# EAGLE design RH026.1 (EAGLE 7.1.0)
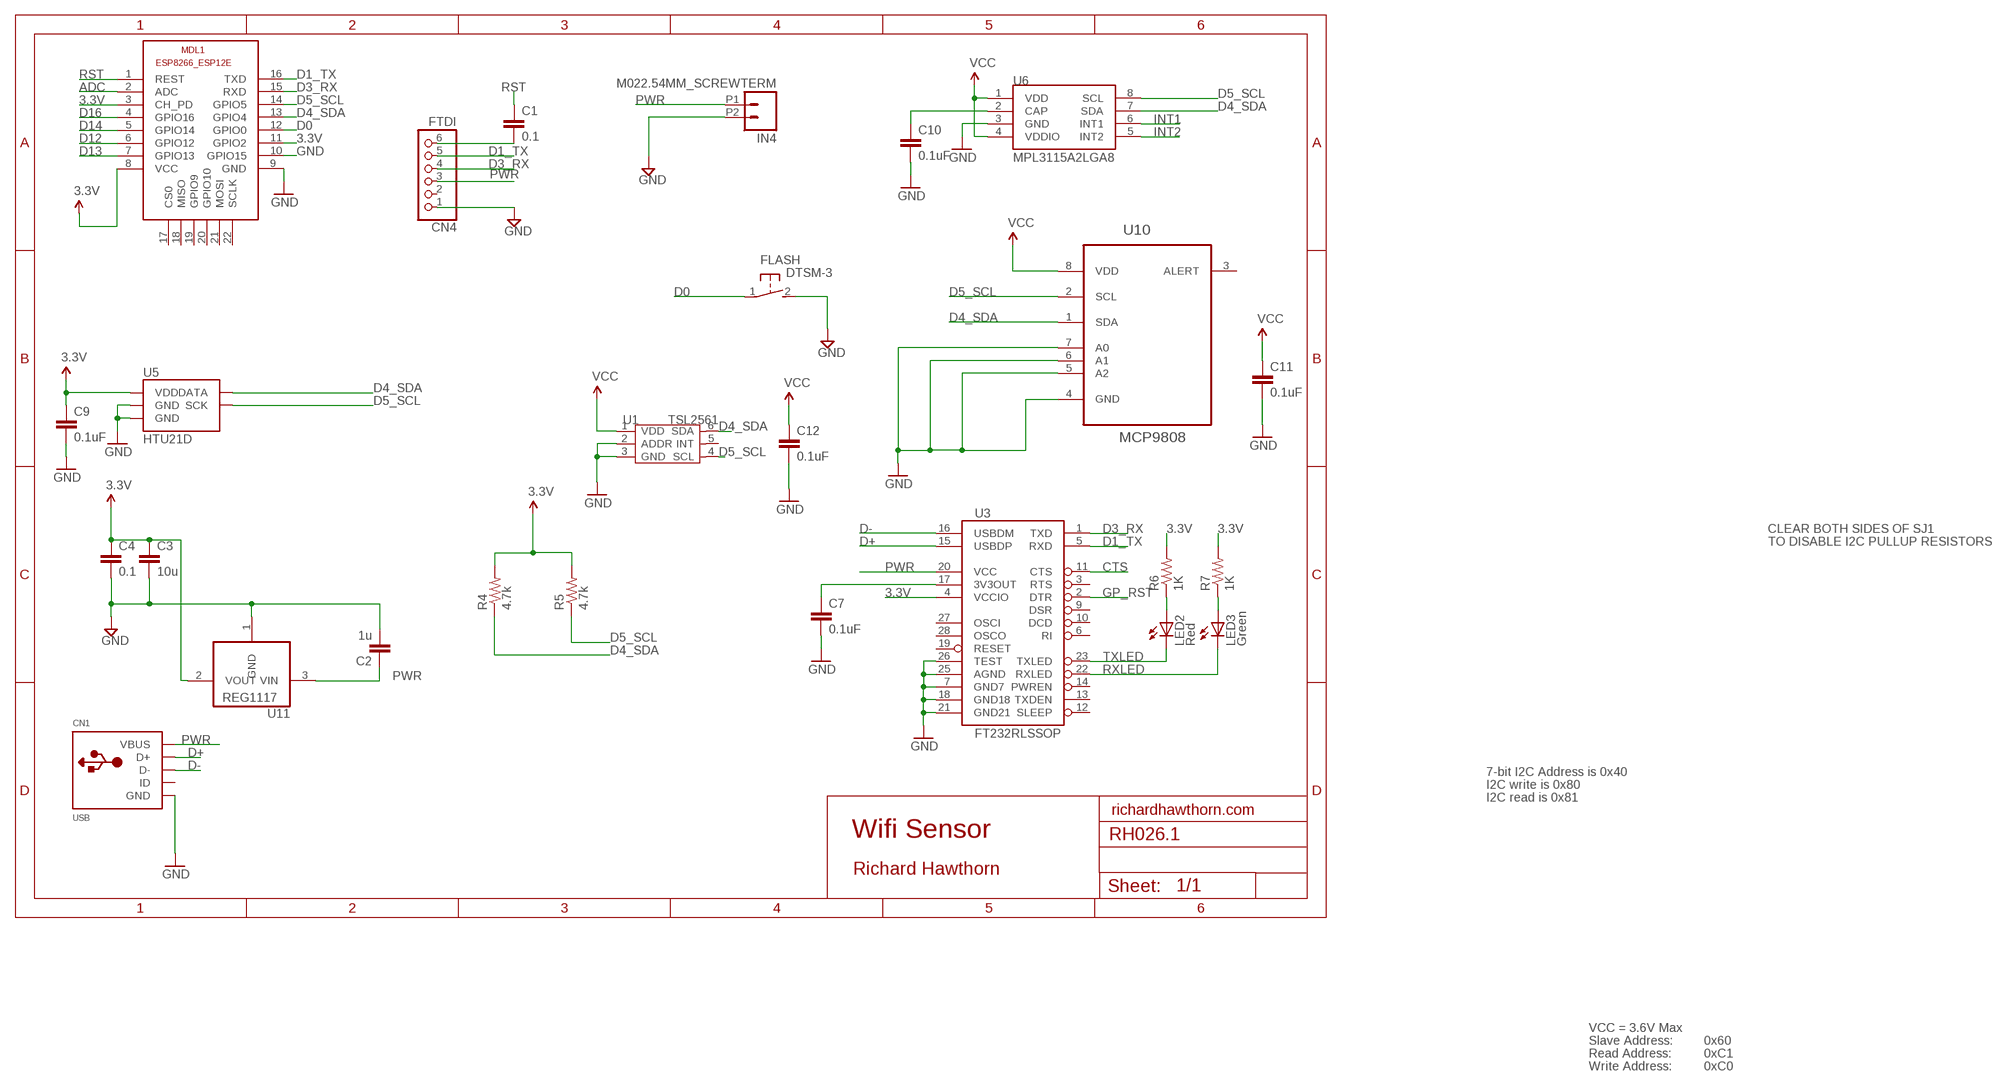
[diagram p0: schematic, sheet 1]

## Parts
C1  0.1  CAP0603-CAP  [0603-CAP]
C2  1u  CAP0603-CAP  [0603-CAP]
C3  10u  CAP0805-CAP  [0805-CAP]
C4  0.1  CAP0603-CAP  [0603-CAP]
C7  0.1uF  CAP0402-CAP  [0402-CAP]
C9  0.1uF  CAP0805  [0805]
C10  0.1uF  CAP0805  [0805]
C11  0.1uF  CAP0603-CAP  [0603-CAP]
C12  0.1uF  CAP0603-CAP  [0603-CAP]
CN1  USB  USBMINIB  [USB-MINIB]
CN4  FTDI  PINHD-1X6  [1X06]
FLASH  DTSM-3  [DTSM-3]
IN4  M022.54MM_SCREWTERM  [1X02_2.54_SCREWTERM]
LED2  Red  LED0603  [LED-0603]
LED3  Green  LED0603  [LED-0603]
MDL1  ESP8266-12EESP8266-ESP12E  [ESP8266-ESP12E]
R4  4.7k  RESISTOR0805-RES  [0805]
R5  4.7k  RESISTOR0805-RES  [0805]
R6  1K  RESISTOR0402-RES  [0402-RES]
R7  1K  RESISTOR0402-RES  [0402-RES]
U1  TSL2561  TSL2561T  [TMB-6]
U3  FT232RLSSOP  [SSOP28DB]
U5  HTU21D  HTU21DSMD  [HTU21D]
U6  MPL3115A2LGA8  [LGA8]
U10  MCP9808  MCP9808-E/MS  [SOP65P490X110-8N]
U11  REG1117  [SOT223]

## Nets
3.3V: C3.1 C4.1 C9.1 C11.1 C12.1 MDL1.3(CH_PD) MDL1.8(VCC) MDL1.11(GPIO2) R4.2 R5.2 R6.2 R7.2 U1.1(VDD) U3.4(VCCIO) U5.VDD U6.1(VDD) U6.4(VDDIO) U10.8(VDD) U11.2(VOUT) ; supply symbol labelled VCC
3.3VOUT: C7.1 U3.17(3V3OUT)
ADC: MDL1.2(ADC)
CTS: U3.11(CTS)
D0: FLASH.1 MDL1.12(GPIO0)
D1_TX: CN4.5 MDL1.16(TXD) U3.5(RXD)
D3_RX: CN4.4 MDL1.15(RXD) U3.1(TXD)
D4_SDA: MDL1.13(GPIO4) R4.1 U1.6(SDA) U5.DATA U6.7(SDA) U10.1(SDA)
D5_SCL: MDL1.14(GPIO5) R5.1 U1.4(SCL) U5.SCK U6.8(SCL) U10.2(SCL)
D12: MDL1.6(GPIO12)
D13: MDL1.7(GPIO13)
D14: MDL1.5(GPIO14)
D16: MDL1.4(GPIO16)
D+: CN1.D+ U3.15(USBDP)
D-: CN1.D- U3.16(USBDM)
GND [power]: C2.2 C3.2 C4.2 C7.2 C9.2 C10.2 C11.2 C12.2 CN1.GND CN4.1 FLASH.2 IN4.P2 MDL1.9(GND) MDL1.10(GPIO15) U1.2(ADDR) U1.3(GND) U3.7(GND7) U3.18(GND18) U3.21(GND21) U3.25(AGND) U3.26(TEST) U5.7(GND) U5.GND U6.3(GND) U10.4(GND) U10.5(A2) U10.6(A1) U10.7(A0) U11.1(GND)
GP_RST: U3.2(DTR)
INT1: U6.6(INT1)
INT2: U6.5(INT2)
N$2: LED2.A R6.1
N$3: LED3.A R7.1
N$9: C10.1 U6.2(CAP)
N$20: C1.2 CN4.6
PWR [power]: C2.1 CN1.VBUS CN4.3 IN4.P1 U3.20(VCC) U11.3(VIN)
RST: C1.1 MDL1.1(REST)
RXLED: LED3.C U3.22(RXLED)
TXLED: LED2.C U3.23(TXLED)
Unconnected: CN1.ID CN4.2 MDL1.17(CS0) MDL1.18(MISO) MDL1.19(GPIO9) MDL1.20(GPIO10) MDL1.21(MOSI) MDL1.22(SCLK) U1.5(INT) U3.3(RTS) U3.6(RI) U3.9(DSR) U3.10(DCD) U3.12(SLEEP) U3.13(TXDEN) U3.14(PWREN) U3.19(RESET) U3.27(OSCI) U3.28(OSCO) U10.3(ALERT)

## Notes on the sheet
- CLEAR BOTH SIDES OF SJ1
- TO DISABLE I2C PULLUP RESISTORS
- 7-bit I2C Address is 0x40
- I2C write is 0x80
- I2C read is 0x81
- richardhawthorn.com
- Wifi Sensor
- Richard Hawthorn
- VCC = 3.6V Max
- Slave Address: | 0x60
- Read Address: | 0xC1
- Write Address: | 0xC0

## Library data of the parts
C1-C4 = LowPowerLab:CAP: Capacitor Standard 0603 ceramic capacitor, and 0.1" leaded capacitor.
C7 C9-C12 = SparkFun:CAP: Capacitor Standard 0603 ceramic capacitor, and 0.1" leaded capacitor.
CN1 = LowPowerLab:USB: USB Connectors USBMINIB - Surface Mount Female Mini-B USB Connector 4UConnector: 06564 By microbuilder.eu Thru-hole RA Female Mini-B USB Connector 4UConnector: 18732 By ladyada.net
CN4 = pinhead:PINHD-1X6: PIN HEADER
FLASH = switch-tact:DTSM-3
IN4 = SparkFun-Connectors:M02: Standard 2-pin 0.1" header. Use with - straight break away headers ( PRT-00116) - right angle break away headers (PRT-00553) - swiss pins (PRT-00743) - machine pins (PRT-00117) - female headers (PRT-00115) Molex polarized connector foot print use with: PRT-08233 with associated crimp pins and housings. 2.54_SCREWTERM for use with PRT-10571. 3.5mm Screw Terminal footprints for PRT-08084 5mm Screw Terminal footprints for use with PRT-08432
LED2 LED3 = SparkFun:LED: LEDs Standard schematic elements and footprints for 5mm, 3mm, 1206, and 0603 sized LEDs. 5mm - Spark Fun Electronics SKU : COM-00529 (and others)
MDL1 = ESP8266-ESP12E:ESP8266-12E: ESP8266-12E with additional I/O and GPIO04/05 corrected The author cannot warrant that this library is free from error or will meet your specific requirements. Created by PuceBaboon.com. Komagane, Nagano, JAPAN
R4-R7 = SparkFun:RESISTOR: Resistor Basic schematic elements and footprints for 0603, 1206, and PTH resistors.
U1 = template:TSL2561: Light-TO-Digital Converter
U3 = SparkFun:FT232RL: USB UART FT232RL 4th Generation USB UART (USB <-> Serial) Controller. Spark Fun Electronics SKU : COM-00650
U5 = SparkFun-Sensors:HTU21D
U6 = SparkFun-Sensors:MPL3115A2: Altimeter/Pressure Sensor, I2C, 1.95V-3.6V supply, 50 to 110kPa
U10 = Richard1:MCP9808-E/MS: Digital Temperature Sensor,MSOP-8; MPN: MCP9808-E/MS; OC_FARNELL: 2080523; OC_NEWARK: 89T8871; PACKAGE: MSOP-8; SUPPLIER: MICROCHIP
U11 = burr-brown:REG1117: 800mA and 1A Low Dropout (LDO) Positive Regulator 1.8V, 2.5V, 2.85V, 3.3V, 5V, and Adj; MPN: REG1117; OC_FARNELL: 1097566; OC_NEWARK: 14P6981

## Net classes
1 power: width 0.381 mm, clearance 0.254 mm

## Board
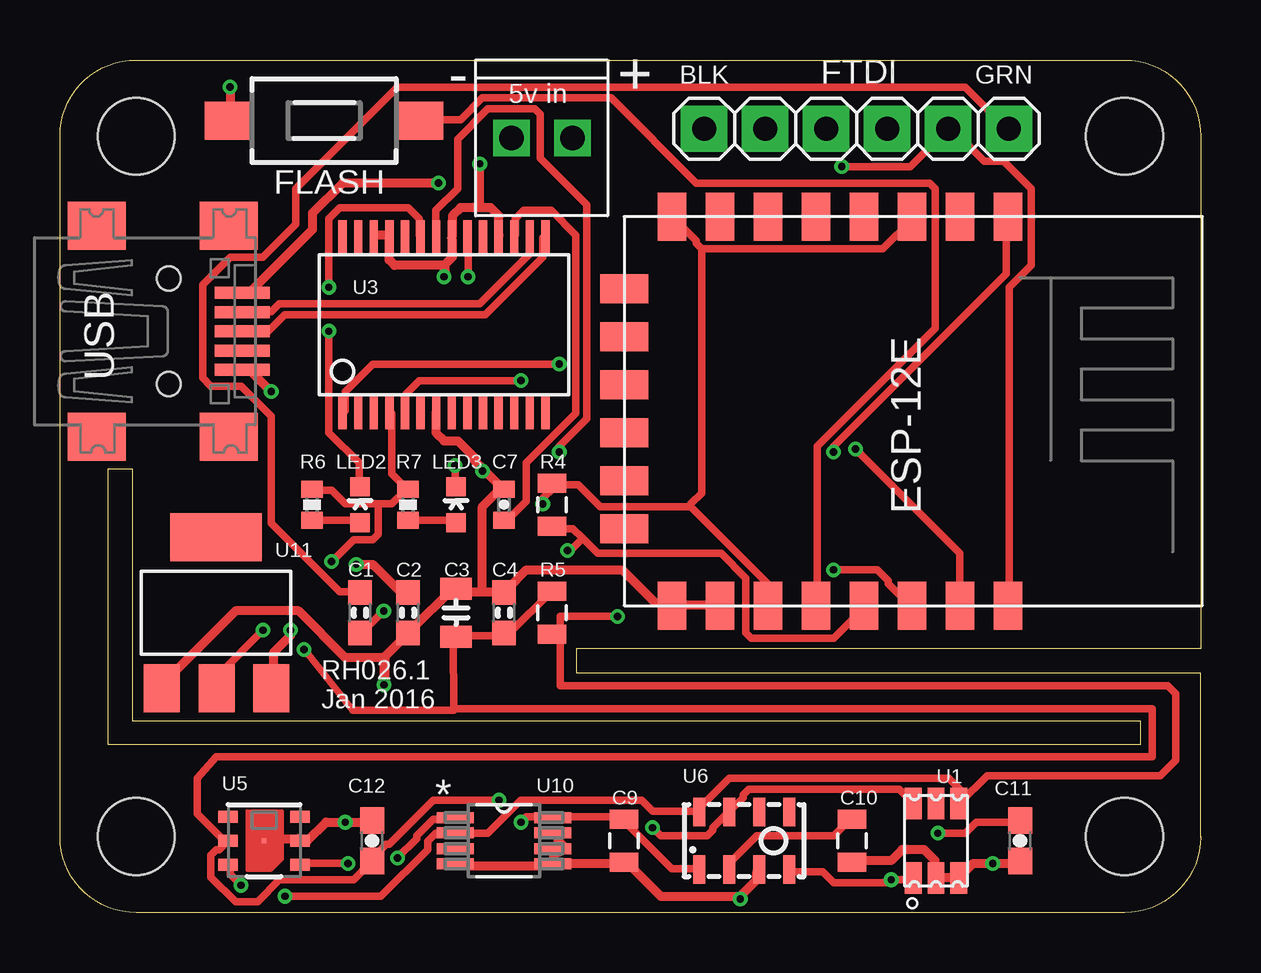
[diagram p1: board, top side]
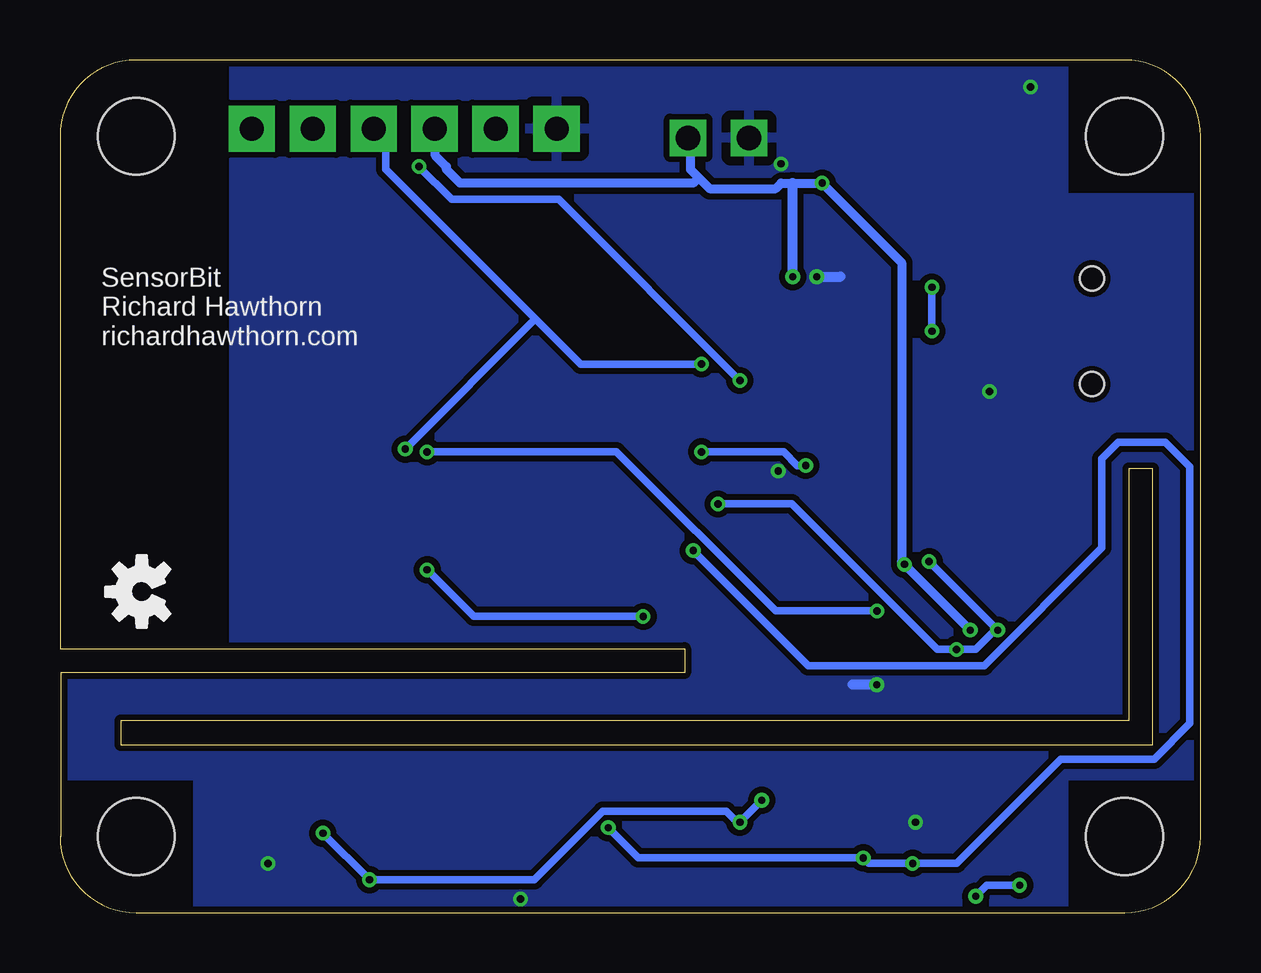
[diagram p2: board, bottom side, seen from below]

Size 47.53 x 35.53 mm. Coordinates in mm from the lower left corner, seen from the top.
Outline: 0,3.17 0,32.35 arc-90 3.17,35.53 44.35,35.53 arc-90 47.53,32.35 47.53,11 21.5,11 21.5,10 47.5,10 47.5,3.17 47.53,3.17 arc-90 44.35,0 3.17,0 arc-90 0,3.17
Outline: 2,7 2,18.5 3,18.5 3,8 45,8 45,7 2,7
Copper layers (1*16): Top 0.035mm / dielectric 1.5mm / Bottom 0.035mm
Design rules "ITEADstudio_DRC *": minimum track width 12mil, minimum drill 12mil, track to track 6mil, track to pad 6mil, pad to pad 6mil, via to via 6mil, smd to smd 0mil, copper to edge 10mil, drill to drill 10mil, minimum pad ring 10mil, minimum via ring 6mil, stop-mask expansion 2mil, vias tented up to drill 100mil, thermal gap 15mil
Holes 3.2 mm at 3.17,3.17 44.35,3.17 3.17,32.35 44.35,32.35
tRestrict: area 40.5,11 to 47.5,35.5; area 42,0 to 47.5,5.5; area 0,30 to 5.5,35.5; area 0,0 to 5.5,5.5
bRestrict: area 40.5,11 to 47.5,35.5; area 0,0 to 5.5,5.5; area 42,0 to 47.5,5.5; area 0,30 to 5.5,35.5

### Footprints (pad centres in the part's own frame; a part is rotated, then mirrored left to right if it is on the bottom)
0603-CAP = smd 1.016 x 0.965: 1 -0.85,0; 2 0.85,0
0805-CAP = smd 0.902 x 1.3: 1 -1,0; 2 1,0
0402-CAP = smd 0.7 x 0.9: 1 -0.65,0; 2 0.65,0
0805 = smd 0.8 x 1.2: 1 -0.9,0; 2 0.9,0
0603-CAP' = smd 1.1 x 1: 1 -0.85,0; 2 0.85,0
USB-MINIB = smd 0.5 x 2.308: D+ 0,4.064; D- -0.8,4.064; GND 1.6,4.064; ID 0.8,4.064; VBUS -1.6,4.064 | smd 2 x 2.4: GND1 -4.4,-2; GND2 -4.4,3.5; GND3 4.4,3.5; GND4 4.4,-2 | hole 1: -2.2,1; 2.2,1
1X06 = drill 1 pad 1.93 square: 1 -6.35,0; 2 -3.81,0; 3 -1.27,0; 4 1.27,0; 5 3.81,0; 6 6.35,0
DTSM-3 = smd 2 x 1.6: 1 -3.97,0; 2 3.97,0
1X02_2.54_SCREWTERM = drill 1.016 square: P1 2.54,0; P2 0,0
LED-0603 = smd 0.8 x 0.8: A 0,-0.75; C 0,0.75
ESP8266-ESP12E = smd 2 x 1.2: 1 0,16; 2 0,14; 3 0,12; 4 0,10; 5 0,8; 6 0,6; 7 0,4; 8 0,2; 9 16.2,2; 10 16.2,4; 11 16.2,6; 12 16.2,8; 13 16.2,10; 14 16.2,12; 15 16.2,14; 16 16.2,16 | smd 1.2 x 2: 17 11,0; 18 3,0; 19 5,0; 20 13,0; 21 7,0; 22 9,0
0402-RES = smd 0.7 x 0.9: 1 -0.65,0; 2 0.65,0
TMB-6 = smd 1.3 x 0.7: 1 -1.55,0.95; 2 -1.55,0; 3 -1.55,-0.95; 4 1.55,-0.95; 5 1.55,0; 6 1.55,0.95
SSOP28DB = smd 0.348 x 1.397: 1 -4.225,-3.656; 2 -3.575,-3.656; 3 -2.925,-3.656; 4 -2.275,-3.656; 5 -1.625,-3.656; 6 -0.975,-3.656; 7 -0.325,-3.656; 8 0.325,-3.656; 9 0.975,-3.656; 10 1.625,-3.656; 11 2.275,-3.656; 12 2.925,-3.656; 13 3.575,-3.656; 14 4.225,-3.656; 15 4.225,3.656; 16 3.575,3.656; 17 2.925,3.656; 18 2.275,3.656; 19 1.625,3.656; 20 0.975,3.656; 21 0.325,3.656; 22 -0.325,3.656; 23 -0.975,3.656; 24 -1.625,3.656; 25 -2.275,3.656; 26 -2.925,3.656; 27 -3.575,3.656; 28 -4.225,3.656
HTU21D = smd 0.2 x 0.2: 7 0,0 | smd 0.8 x 0.5: DATA 1.5,-1; GND 1.5,0; NC@1 -1.5,1; NC@6 1.5,1; SCK -1.5,-1; VDD -1.5,0
LGA8 = smd 1.2 x 0.5: 1 -1.2,1.875; 2 -1.2,0.625; 3 -1.2,-0.625; 4 -1.2,-1.875; 5 1.2,-1.875; 6 1.2,-0.625; 7 1.2,0.625; 8 1.2,1.875
SOP65P490X110-8N = smd 1.524 x 0.457: 1 -2.032,0.965; 2 -2.032,0.33; 3 -2.032,-0.33; 4 -2.032,-0.965; 5 2.032,-0.965; 6 2.032,-0.33; 7 2.032,0.33; 8 2.032,0.965
SOT223 = smd 1.499 x 2.007: 1 -2.261,-3.15; 2 0.025,-3.15; 3 2.311,-3.15 | smd 3.81 x 2.007: 4 0,3.15

### Placement (x,y rotation side)
C1  12.5,12.5 90 top
C2  14.5,12.5 270 top
C3  16.5,12.5 90 top
C4  18.5,12.5 90 top
C7  18.5,17 90 top
C9  23.5,3 270 top
C10  33,3 270 top
C11  0.1uF  [0603-CAP']  40,3 270 top
C12  0.1uF  [0603-CAP']  13,3 90 top
CN1  3.53,24.23 270 top
CN4  33.19,32.67 0 top
FLASH  11,33 180 top
IN4  18.82,32.28 0 top
LED2  12.5,17 0 top
LED3  16.5,17 0 top
MDL1  23.5,29 270 top
R4  20.5,17 90 top
R5  20.5,12.5 90 top
R6  10.5,17 90 top
R7  14.5,17 90 top
U1  36.5,3 90 top
U3  16,24.5 0 top
U5  8.5,3 0 top
U6  28.5,3 90 top
U10  18.5,3 0 top
U11  6.5,12.5 0 top
U$3  [OSHW-LOGO-S]  44.13,13.38 90 bottom

### Tracks (layer width: path | path; a pad name or v marks a point on that pad's centre or on a via)
3.3V  (via drill 0.3)
  Top 0.305: v36.58,3.31 37.72,3.31 38.18,3.77 39.89,3.77 C11.1 | U1.1 35.55,1.37 v34.63,1.37 34.63,1.26 32.23,1.26 31.77,1.71 30.4,1.71 U6.4 | U6.1 26.52,1.83 25.49,1.83 23.55,3.77 C9.1 23.43,4 20.57,4 U10.8 20.46,4 19.43,4 v19.2,3.77 | v18.29,4.69 15.54,4.69 13.72,2.86 13.6,2.86 13.03,2.29 C12.1 12.92,2.06 12.23,1.37 9.14,1.37 8.23,0.46 7.32,0.46 6.29,1.49 6.29,2.4 6.51,2.63 6.63,2.63 6.97,2.97 U5.VDD 6.86,2.97 5.71,4.12 5.71,5.6 6.5,6.5 45.5,6.5 45.5,8.5 16.4,8.5 | R5.2 20.46,13.37 18.75,11.66 18.63,11.66 C4.1 18.4,11.54 16.57,11.54 C3.1 16.46,11.43 16.39,11.43 16.4,8.5 | 13.26,17.03 13.83,17.03 14.4,17.6 R7.2 14.4,17.72 13.83,18.29 13.83,20.8 U3.4 | 13.26,17.03 11.89,17.03 11.32,17.6 10.52,17.6 R6.2 | v8.46,11.77 6.63,9.94 6.63,9.37 U11.2 | v11.32,14.63 12.23,15.54 13.03,15.54 13.26,15.77 13.26,17.03 | 16.4,8.5 16.4,8.44 12.2,8.44 v10.17,10.97 | 26.75,27.66 26.52,27.89 26.52,28 25.6,28.92 MDL1.8 | 26.75,27.66 34.29,27.66 35.55,28.92 MDL1.3 | 26.29,16.92 22.52,16.92 21.6,17.83 20.57,17.83 R4.2 20.57,17.72 20.12,17.26 v20.12,17.03 | 26.29,16.92 29.49,13.72 MDL1.11 | 26.75,27.66 26.75,17.49 26.29,17.03 26.29,16.92
  Bottom 0.305: v36.58,3.31 v34.63,1.37 27.77,1.37 24.92,4.23 19.77,4.23 19.32,3.77 v19.2,3.77 v18.29,4.69 | v11.32,14.63 v8.46,11.77 8.57,11.77 9.37,10.97 v10.17,10.97 10.97,10.97 17.03,17.03 v20.12,17.03
3.3VOUT
  Top 0.305: C7.1 18.52,16.46 18.75,16.46 19.43,17.14 19.43,18.75 21.49,20.8 21.49,28.23 20.46,29.26 19.32,29.26 18.97,28.92 18.97,28.23 U3.17
D0
  Top 0.305: FLASH.1 14.97,33.03 16.69,33.03 17.6,33.95 22.97,33.95 26.52,30.4 36.23,30.4 36.46,30.18 36.46,24.35 31.55,19.43 31.55,12.8 MDL1.12
D1_TX  (via drill 0.3)
  Top 0.305: v19.2,22.17 14.97,22.17 14.4,21.6 14.4,20.92 U3.5 | v32.58,31.09 35.43,31.09 36.92,32.58 CN4.5 37.15,32.69 38.52,31.32 39.32,31.32 40.46,30.18 40.46,26.98 39.55,26.06 39.55,12.8 MDL1.16
  Bottom 0.305: v19.2,22.17 26.75,29.72 31.2,29.72 v32.58,31.09
D3_RX  (via drill 0.3)
  Top 0.305: v20.8,22.86 13.03,22.86 11.89,21.72 11.89,20.92 U3.1 | v33.15,19.32 37.49,14.97 MDL1.15
  Bottom 0.305: v20.8,22.86 25.83,22.86 27.72,24.75 | 27.72,24.75 33.95,30.98 33.95,32.12 34.4,32.58 CN4.4 | 27.72,24.75 v33.15,19.32
D4_SDA  (via drill 0.3)
  Top 0.305: 21.77,15.6 22.4,14.97 27.55,14.97 28.57,13.95 28.57,11.66 28.8,11.43 32.23,11.43 33.49,12.69 MDL1.13 | 21.77,15.6 21.37,16 20.57,16 R4.1 | U1.6 35.55,4.57 34.98,5.14 28.69,5.14 28.46,4.92 28.46,4.8 27.89,4.23 U6.7 27.77,4.12 27.2,3.54 27.2,3.43 26.98,3.2 25.03,3.2 v24.69,3.54 | v12,2.06 10.06,2.06 U5.DATA | v14.06,2.29 14.86,3.09 14.86,3.2 15.54,3.89 16.46,3.89 U10.1 | 21.77,15.6 21.26,15.09 v21.14,15.09
  Bottom 0.305: v24.69,3.54 23.43,2.29 v14.06,2.29 13.83,2.06 v12,2.06 10.17,2.06 5.83,6.4 1.94,6.4 0.46,7.89 0.46,18.57 1.49,19.6 3.43,19.6 4.12,18.92 4.12,15.2 9.03,10.29 16.34,10.29 v21.14,15.09
D5_SCL  (via drill 0.3)
  Top 0.305: v7.54,1.14 7.09,1.6 7.09,1.94 U5.SCK | v9.37,0.69 13.37,0.69 15.32,2.63 15.32,2.97 15.66,3.31 16.46,3.31 U10.2 16.57,3.31 17.83,3.31 19.2,4.69 24.23,4.69 24.69,4.23 26.52,4.23 U6.8 26.63,4.34 27.89,5.6 37.03,5.6 37.72,4.92 U1.4 37.49,4.57 38.63,5.71 45.85,5.71 46.49,6.36 46.49,9.12 46.15,9.46 20.85,9.46 20.85,10.46 20.85,11.54 | 20.85,11.54 20.57,11.54 R5.1 | v32.23,14.29 34.06,14.29 34.52,13.83 34.52,13.72 35.43,12.8 MDL1.14 | 20.85,11.54 20.85,12.34 v23.23,12.34
  Bottom 0.305: v7.54,1.14 8.91,1.14 v9.37,0.69 | v32.23,14.29 30.29,12.34 v23.23,12.34
D+
  Top 0.305: U3.15 20.12,28.12 20.12,27.32 17.72,24.92 9.37,24.92 8.69,24.23 7.66,24.23 CN1.D+
D-
  Top 0.305: U3.16 19.55,28.12 19.55,27.43 17.49,25.38 9.14,25.38 8.8,25.03 7.66,25.03 CN1.D-
GND  (via drill 0.3)
  Top 0.381: 17.66,18.46 17.26,18.86 17.26,18.97 16.57,19.66 16,19.66 15.66,20 15.66,20.8 U3.7 | 17.66,18.46 18.4,17.72 C7.2 18.29,17.6 17.6,16.92 17.6,13.37 | MDL1.10 27.43,12.8 25.6,12.8 MDL1.9 25.38,12.92 24.8,12.92 23.43,14.29 19.43,14.29 18.63,13.49 C4.2 18.4,13.37 17.6,13.37 | 17.6,13.37 16.57,13.37 C3.2 16.46,13.6 14.52,11.66 C2.2 14.4,11.54 13.49,10.63 11.89,10.63 9.94,12.57 7.32,12.57 4.34,9.6 4.34,9.37 U11.1 | U10.5 20.57,2.06 23.43,2.06 C9.2 23.66,2.06 25.03,0.69 28.35,0.69 | 28.35,0.69 29.03,1.37 29.03,1.71 U6.3 | U10.4 16.57,1.94 20.46,1.94 U10.5 | U10.5 20.57,2.17 20.57,2.63 U10.6 20.75,2.5 21,2.75 20.75,3 20.75,3.25 U10.7 | C11.2 39.89,2.06 v38.86,2.06 38.06,2.06 37.49,1.49 U1.3 37.26,1.49 36.58,1.49 U1.2 36.46,1.49 36.46,2.17 36.01,2.63 35.09,2.63 34.63,2.17 33.03,2.17 C10.2 | U5.7 8.57,3.09 9.94,3.09 U5.GND 10.17,2.97 10.29,2.97 11.09,3.77 v11.89,3.77 12.92,3.77 C12.2 | v7.09,34.4 7.09,33.03 FLASH.2 | U3.26 13.14,28.23 13.72,28.23 U3.25 13.72,28 13.72,27.2 13.95,26.98 16,26.98 16.34,27.32 16.34,28 U3.21 16.34,28.23 16.34,29.03 16.69,29.38 17.49,29.38 | 17.49,29.38 17.95,29.38 18.29,29.03 18.29,28.23 U3.18 | 17.49,29.38 v17.49,31.2 | v8.8,21.72 7.89,22.63 7.66,22.63 CN1.GND | v28.35,0.57 28.35,0.69 | v17.6,18.4 17.66,18.46
  Top 0.406: 16,26.98 v16,26.5 | 13.49,10.63 13.5,10.63 v13.5,9.5
  Bottom 0.406: v16,26.5 15,26.5 | v13.5,9.5 14.5,9.5
  pour Bottom: 0,35.5 47.5,35.5 47.5,0 0,0
N$2
  Top 0.305: LED2.A 12.46,16.34 10.52,16.34 R6.1
N$3
  Top 0.305: LED3.A 16.46,16.34 14.52,16.34 R7.1
N$9
  Top 0.305: U6.2 27.89,1.83 27.89,2.06 29.03,3.2 32.23,3.2 32.92,3.89 C10.1
N$20
  Top 0.305: C1.2 12.46,13.37 11.66,13.37 8.8,16.23 8.8,20.69 7.54,21.95 6.29,21.95 5.94,22.29 5.94,26.18 7.09,27.32 8.46,27.32 9.83,28.69 9.83,30.18 14.06,34.4 37.72,34.4 39.43,32.69 CN4.6
PWR  (via drill 0.3)
  Top 0.3: U3.20 17,28.16
  Top 0.305: 17,28.16 v17,26.5
  Top 0.381: v12.34,14.52 13.03,14.52 14.17,13.37 14.4,13.37 C2.1 | v9.6,11.77 9.6,11.54 8.91,10.86 8.91,9.37 U11.3 | v15.77,30.4 11.77,30.4 10.52,29.15 10.52,28.46 7.89,25.83 7.66,25.83 CN1.VBUS
  Bottom 0.381: v9.6,11.77 v12.34,14.52 12.46,14.63 12.46,27.09 v15.77,30.4 17,30.4 17.49,30.4 17.72,30.18 20.46,30.18 20.92,30.63 | 20.92,30.63 21.26,30.98 21.26,32.23 IN4.P1 | CN4.3 31.89,32.58 31.89,31.55 31.43,31.09 31.43,30.98 30.86,30.4 21.14,30.4 20.92,30.63
  Bottom 0.406: v17,26.5 17,30.4
RST  (via drill 0.3)
  Top 0.305: v13.49,12.57 12.57,11.66 C1.1 | v32.23,19.2 32.23,19.43 39.43,26.63 39.43,28.92 MDL1.1
  Bottom 0.305: v13.49,12.57 17.72,12.57 24.35,19.2 v32.23,19.2
RXLED  (via drill 0.3)
  Top 0.305: v16.46,18.63 16.46,17.83 LED3.C | v20.8,19.2 20.8,19.43 21.95,20.57 21.95,29.49 20,31.43 20,33.26 19.77,33.49 17.83,33.49 16.57,32.23 16.57,30.18 15.66,29.26 15.66,28.23 U3.22
  Bottom 0.305: v16.46,18.63 16.8,18.63 17.37,19.2 v20.8,19.2
TXLED  (via drill 0.3)
  Top 0.305: v11.2,24.23 11.2,20 12.46,18.75 12.46,17.83 LED2.C | v11.2,26.06 11.2,28.92 11.66,29.38 14.52,29.38 14.97,28.92 14.97,28.23 U3.23
  Bottom 0.305: v11.2,26.06 v11.2,24.23

### Text on the board
tNames: BLK | FTDI | GRN | - | 5v in | + | RH026.1 / Jan 2016
bNames: SensorBit / Richard Hawthorn / richardhawthorn.com
tDocu: REG